# Altium schematic sheet Buttons.SchDoc
size Letter; CompanyName: Ploopy Corporation; Organization: Ploopy Corporation; Address1: 137-1140 Burnhamthorpe Road W; Address2: Mississauga; Address3: Ontario; Address4: Canada L5C 0A3; DocumentNumber: 2; Revision: R1.001; SheetNumber: 2; SheetTotal: 7
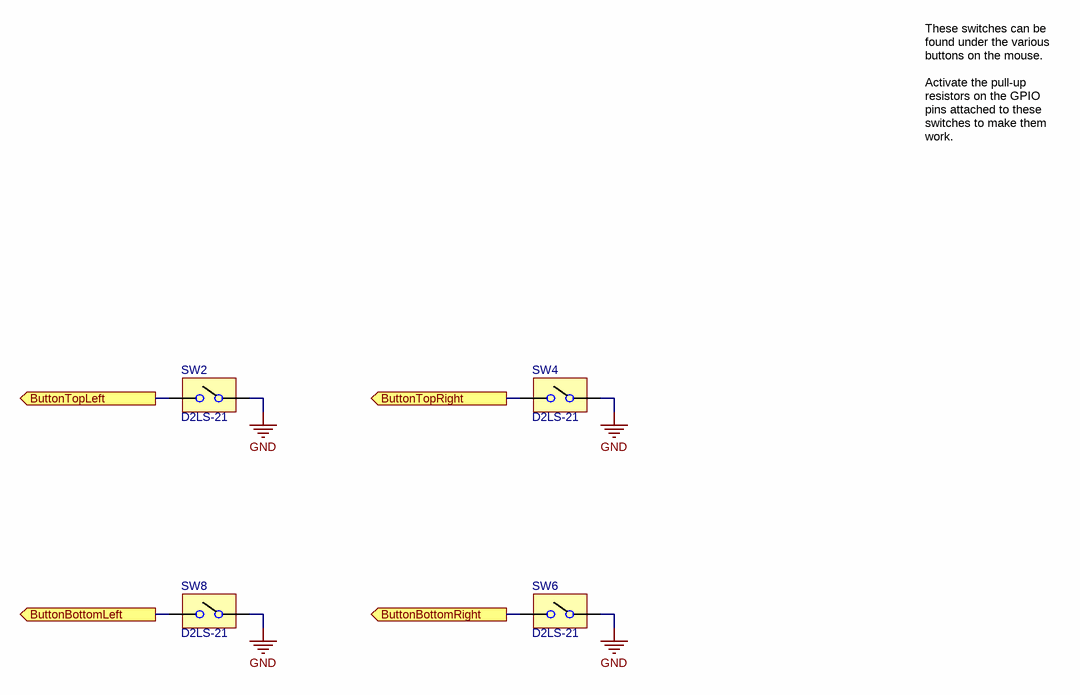
[diagram p0: Buttons.SchDoc]

## Parts
SW2  D2LS-21  [D2LS-21]
SW4  D2LS-21  [D2LS-21]
SW6  D2LS-21  [D2LS-21]
SW8  D2LS-21  [D2LS-21]

## Ports
ButtonBottomLeft (out), ButtonBottomRight (out), ButtonTopLeft (out), ButtonTopRight (out)

## Nets
GND: SW2.A SW4.A SW6.A SW8.A
ButtonBottomLeft: SW8.B ; port ButtonBottomLeft
ButtonBottomRight: SW6.B ; port ButtonBottomRight
ButtonTopLeft: SW2.B ; port ButtonTopLeft
ButtonTopRight: SW4.B ; port ButtonTopRight

## Notes on the sheet
- These switches can be found under the various buttons on the mouse.
  Activate the pull-up resistors on the GPIO pins attached to these switches to make them work.
- Copyright Ploopy Corporation
- Licensed under the CERN-OHL-S v2
- http://ohwr.org/cernohl
- Title:
- PCB:
- Version:
- Ploopy Corporation
- Mississauga ON L5C 0A3
- 137-1140 Burnhamthorpe Road W
- Date:
- Time:
- Sheet
- of
- Canada

## Library data of the parts
SW2 SW4 SW6 SW8 = D2LS-21: Compact Surface-mounting Switch for long durability; Supplier 1: Digi-Key; Supplier 2: Mouser; Supplier Part Number 1: Z4378CT-ND; Supplier Part Number 2: 653-D2LS-21